# Altium project Dosyn.PrjPcb
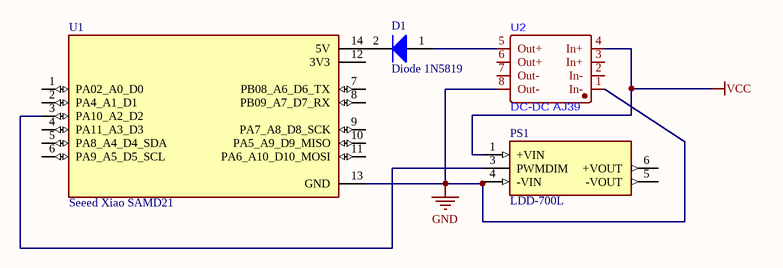
[diagram p0: Dosyn.SchDoc]
1 sheet, 4 parts. Net scope: global (net labels, ports and power ports of the same name join across sheets).
Board file: Dosyn Pad.PcbDoc

## Sheet Dosyn.SchDoc
size A4; SheetNumber: 1; SheetTotal: 1

### Parts
D1  Diode 1N5819  [DO-214AC/SMA]
PS1  LDD-700L  [LDD-XXXL]
U1  Seeed Xiao SAMD21  [MODULE_102010388]
U2  DC-DC AJ39  [DC-DC-AJ39]

### Nets
GND: PS1.4(-VIN) U1.13(GND) U2.1(In-) U2.8(Out-)
VCC: PS1.1(+VIN) U2.4(In+)
NetD1_1: D1.1 U2.5(Out+)
NetD1_2: D1.2 U1.14(5V)
NetPS1_3: PS1.3(PWMDIM) U1.3(PA10_A2_D2)

Not connected (* = marked no-connect by the designer): PS1 5(-VOUT) 6(+VOUT); U1 1(PA02_A0_D0) 2(PA4_A1_D1) 4(PA11_A3_D3) 5(PA8_A4_D4_SDA) 6(PA9_A5_D5_SCL) 7(PB08_A6_D6_TX) 8(PB09_A7_D7_RX) 9(PA7_A8_D8_SCK) 10(PA5_A9_D9_MISO) 11(PA6_A10_D10_MOSI) 12(3V3); U2 2(In-) 3(In+) 6(Out+) 7(Out-)

### Library data of the parts
D1 = Diode 1N5408: 3 Amp Medium Power Silicon Rectifier Diode; Published: 8-Jun-2000; LatestRevisionDate: 17-Jul-2002; LatestRevisionNote: Re-released for DXP Platform.; DatasheetDocument: Aug-1984; PackageReference: DO-201AD; Publisher: Altium Limited; ComponentLink1Description: Manufacturer Link; ComponentLink1URL: http://www.irf.com/
PS1 = LDD-700L: Power Supply; Manufacturer_Name: Mean Well; Datasheet Link: https://datasheet.datasheetarchive.com/originals/distributors/DKDS-14/277848.pdf; Manufacturer_Part_Number: LDD-700L; Mouser Part Number: 709-LDD-700L; Mouser Price/Stock: https://www.mouser.co.uk/ProductDetail/MEAN-WELL/LDD-700L?qs=erfQA2AIGbUwgFnDklbVsA%3D%3D; Arrow Part Number: LDD-700L; Arrow Price/Stock: https://www.arrow.com/en/products/ldd-700l/mean-well-enterprises?region=nac
U1 = 102010388: Seeeduino XIAO Development Board, Pre-Soldered [Seeed Studio] 102010388 Seeeduino XIAO Development Board, Pre-Soldered; MF: Seeed Technology Co., Ltd; Price: None; Availability: In Stock; Check_prices: https://www.snapeda.com/parts/102010388/Seeed+Technology+Co.%252C+Ltd/view-part/?ref=eda; MP: 102010388; Package: None; SnapEDA_Link: https://www.snapeda.com/parts/102010388/Seeed+Technology+Co.%252C+Ltd/view-part/?ref=snap; Value: *; Purchase-URL: https://pricing.snapeda.com/search/part/102010388/?ref=eda
U2 = DC-DC AJ39: 36V in 5V out